# Altium schematic sheet DMUX_JTAG.SchDoc: DMUX JTAG
size A4
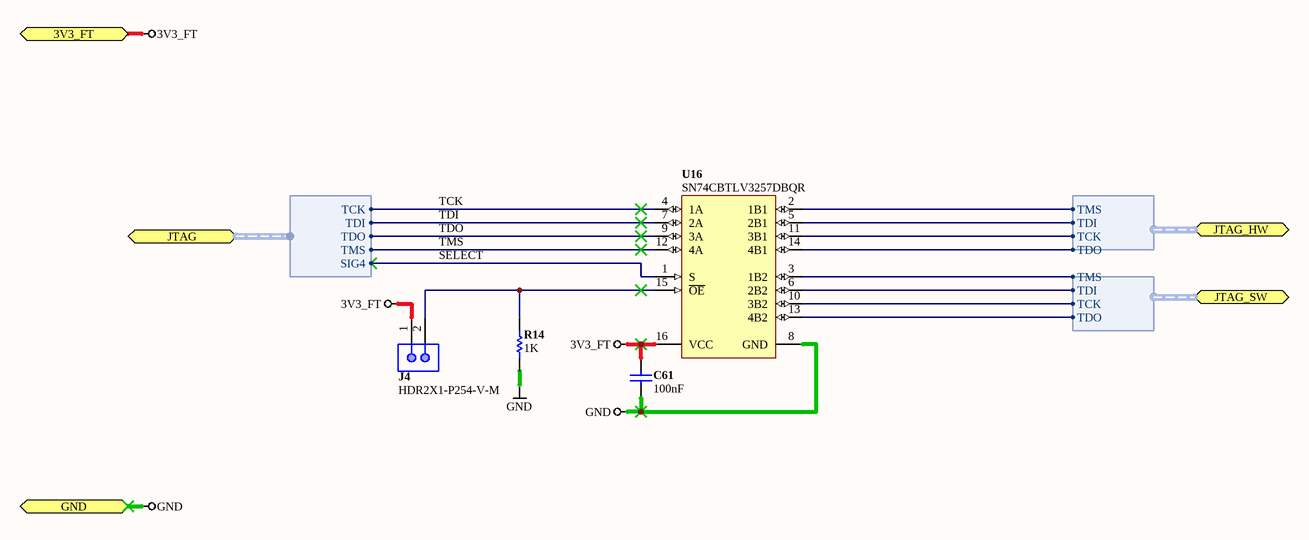
[diagram p0: DMUX_JTAG.SchDoc]

## Parts
C61  value 100nF  [CAPC0402(1005)60_N]  (hidden comment: CAP 100nF 6.3V 0402(1005))
J4  HDR2X1-P254-V-M  [HDR2X1-P254-V-M]
R14  value 1K  [RESC0402(1005)_N]  (hidden comment: 1K 1% 0402(1005))
U16  SN74CBTLV3257DBQR  [SSOP-16_N]

## Ports
3V3_FT, GND, JTAG (harness JTAG), JTAG_HW (harness JTAG_HW), JTAG_SW (harness JTAG_SW)

## Harnesses
JTAG_HW: TCK, TDO, TMS, TDI
JTAG_SW: TCK, TDO, TMS, TDI
JTAG: TCK, TDI, TDO, TMS, SIG4

## Nets
3V3_FT: C61.2 J4.1 U16.16(VCC) ; port 3V3_FT
GND: C61.1 R14.2 U16.8(GND) ; port GND
SELECT: U16.1(S) ; port JTAG.SIG4
TCK: U16.4(1A) ; port JTAG.TCK
TDI: U16.7(2A) ; port JTAG.TDI
TDO: U16.9(3A) ; port JTAG.TDO
TMS: U16.12(4A) ; port JTAG.TMS
NetJ4_2: J4.2 R14.1 U16.15(~{OE})
NetU16_2: U16.2(1B1) ; port JTAG_HW.TMS
NetU16_3: U16.3(1B2) ; port JTAG_SW.TMS
NetU16_5: U16.5(2B1) ; port JTAG_HW.TDI
NetU16_6: U16.6(2B2) ; port JTAG_SW.TDI
NetU16_10: U16.10(3B2) ; port JTAG_SW.TCK
NetU16_11: U16.11(3B1) ; port JTAG_HW.TCK
NetU16_13: U16.13(4B2) ; port JTAG_SW.TDO
NetU16_14: U16.14(4B1) ; port JTAG_HW.TDO

## Notes on the sheet
- Sheet Title
- Project Title
- Size:
- Date:
- A4
- Item:
- Time:
- Revision:
- Sheet
- of
- File:

## Library data of the parts
C61 = CMP-1034-02062-1: CAP 100nF 6.3V ?0% 0402 (1005 Metric) Thickness 0.6mm SMD; Case-EIA: 0402; Case-Metric: 1005; Technology: SMT; Max Thickness: 0.6 mm; Rated Voltage: 6.3 V; Tolerance: ?0%
J4 = CMP-5167-00031-1: Male Header IDC, 1 x 2 Pin Vertical 2.54mm Pitch; Class: Board Connector; Component Kind: Standard
R14 = CMP-1011-00510-1: 1K 0.063W 1% 0402 (1005 Metric)  SMD; Case-Metric: 1005; Case-EIA: 0402; Tolerance: 1 %; Technology: SMT; Power: 0.063 W
U16 = CMP-5097-00006-1: IC QUAD 1:2 FET MUX/DEMUX 16SSOP; Channel: 4; Class: Logic; Sub-class: Switch; Suplply Voltage: 2.3V to 3.6V; Datasheet: http://www.ti.com/lit/ds/symlink/sn74cbtlv3257.pdf; Package Type: SSOP